# EAGLE design Power conversion board (EAGLE 7.7.0)
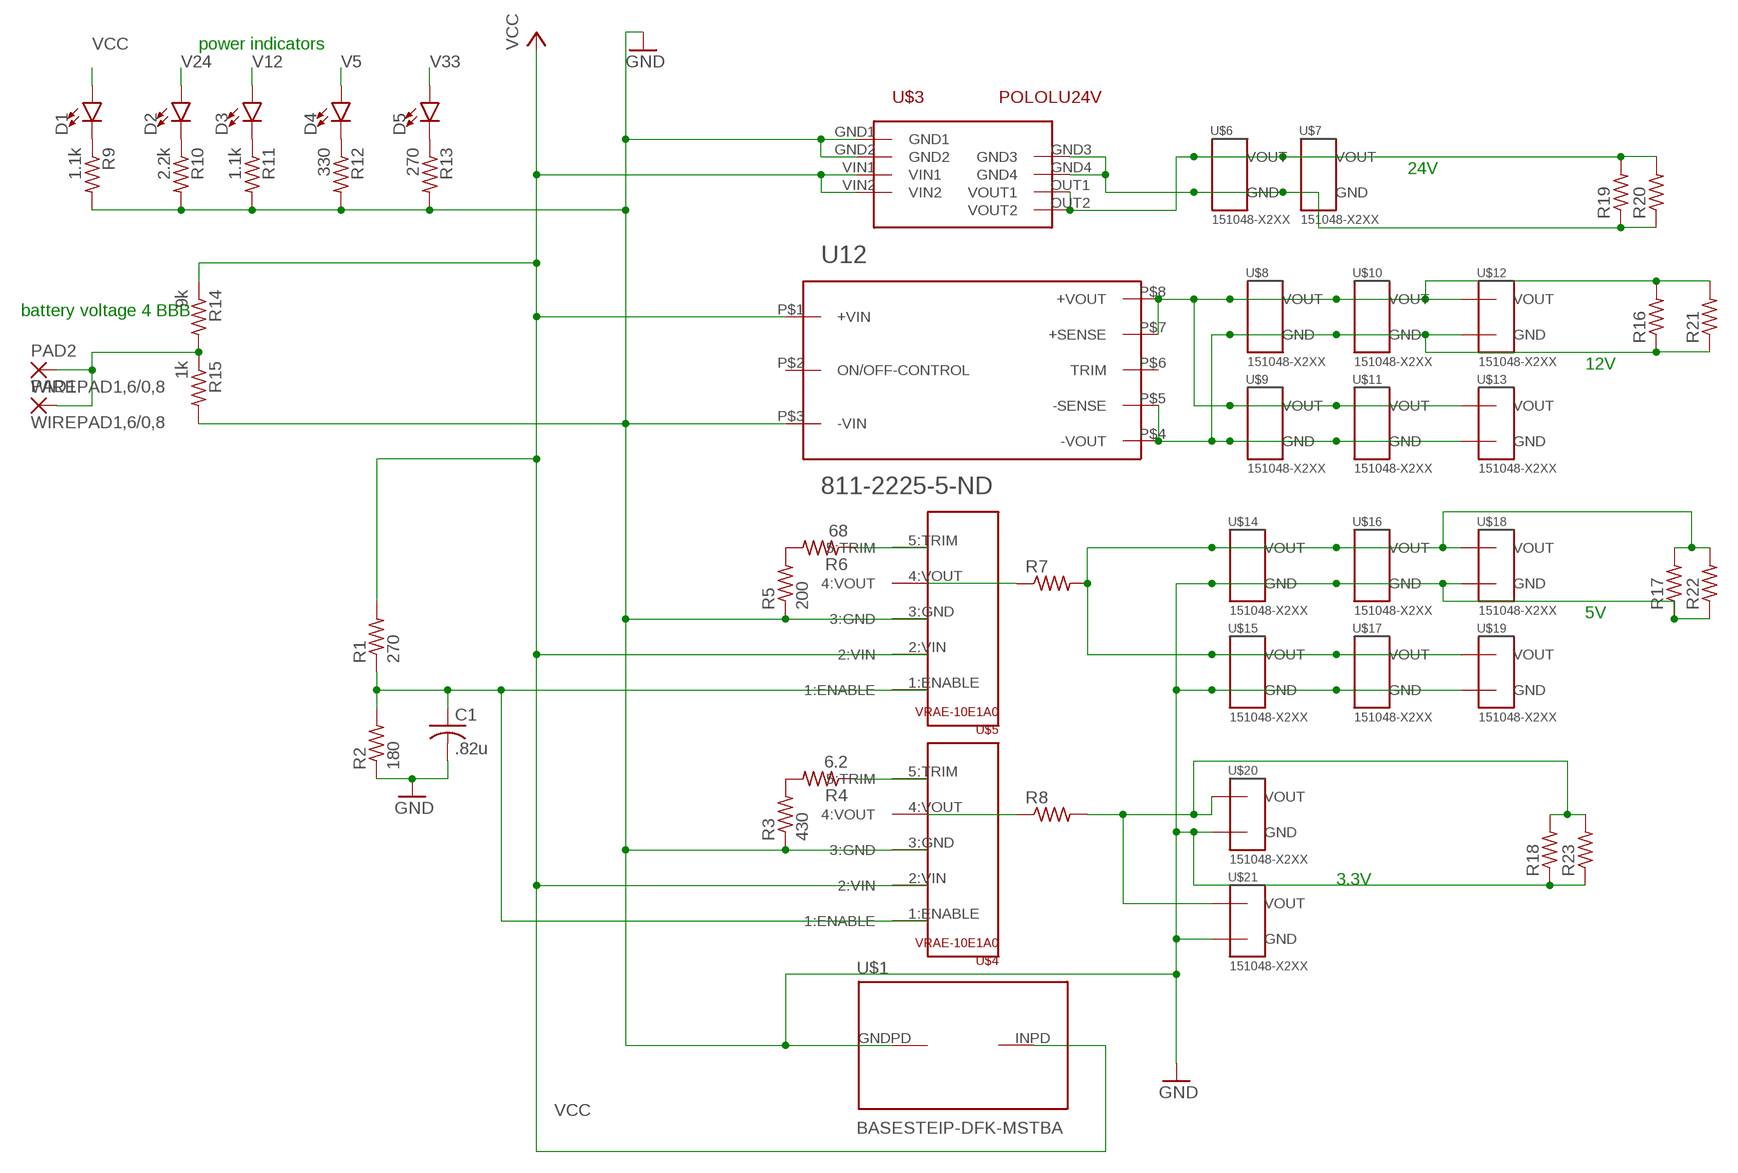
[diagram p0: schematic, sheet 1]

## Parts
C1  .82u  C-USC0603  [C0603]
D1  LED5MM  [LED_5MM]
D2  LED5MM  [LED_5MM]
D3  LED5MM  [LED_5MM]
D4  LED5MM  [LED_5MM]
D5  LED5MM  [LED_5MM]
PAD1  WIREPAD1,6/0,8  [1,6/0,8]
PAD2  WIREPAD1,6/0,8  [1,6/0,8]
R1  270  R-US_R0603  [R0603]
R2  180  R-US_R0603  [R0603]
R3  430  R-US_R0603  [R0603]
R4  6.2  R-US_R0603  [R0603]
R5  200  R-US_R0603  [R0603]
R6  68  R-US_R0603  [R0603]
R7  R-US_0204/5  [00PTCPACKAGE]
R8  R-US_0204/5  [00PTCPACKAGE]
R9  1.1k  R-US_R0603  [R0603]
R10  2.2k  R-US_R0603  [R0603]
R11  1.1k  R-US_R0603  [R0603]
R12  330  R-US_R0603  [R0603]
R13  270  R-US_R0603  [R0603]
R14  9k  R-US_R0603  [R0603]
R15  1k  R-US_R0603  [R0603]
R16  R-US_0204/5  [00PTCPACKAGE]
R17  R-US_0204/5  [00PTCPACKAGE]
R18  R-US_0204/5  [00PTCPACKAGE]
R19  R-US_0204/5  [00PTCPACKAGE]
R20  R-US_0204/5  [00PTCPACKAGE]
R21  R-US_0204/5  [00PTCPACKAGE]
R22  R-US_0204/5  [00PTCPACKAGE]
R23  R-US_0204/5  [00PTCPACKAGE]
U12  811-2225-5-ND  [811-2225-5-ND]
U$1  BASESTEIP-DFK-MSTBA  [BASESTRIP-DFK-MSTBA]
U$3  POLOLU24V  [POLOLU24]
U$4  VRAE-10E1A0  [BEL_VRAE-10E1A0]
U$5  VRAE-10E1A0  [BEL_VRAE-10E1A0]
U$6  151048-X2XX  [151048-X2XX]
U$7  151048-X2XX  [151048-X2XX]
U$8  151048-X2XX  [151048-X2XX]
U$9  151048-X2XX  [151048-X2XX]
U$10  151048-X2XX  [151048-X2XX]
U$11  151048-X2XX  [151048-X2XX]
U$12  151048-X2XX  [151048-X2XX]
U$13  151048-X2XX  [151048-X2XX]
U$14  151048-X2XX  [151048-X2XX]
U$15  151048-X2XX  [151048-X2XX]
U$16  151048-X2XX  [151048-X2XX]
U$17  151048-X2XX  [151048-X2XX]
U$18  151048-X2XX  [151048-X2XX]
U$19  151048-X2XX  [151048-X2XX]
U$20  151048-X2XX  [151048-X2XX]
U$21  151048-X2XX  [151048-X2XX]

## Nets
GND: C1.2 R2.1 R3.1 R5.1 R9.2 R10.2 R11.2 R12.2 R13.2 R15.2 R16.1 R17.1 R18.1 R19.1 R20.1 R21.1 R22.1 R23.1 U12.P$3(-VIN) U12.P$4(-VOUT) U12.P$5(-SENSE) U$1.GNDPD U$3.GND1 U$3.GND2 U$3.GND3 U$3.GND4 U$4.3:GND U$5.3:GND U$6.GND U$7.GND U$8.GND U$9.GND U$10.GND U$11.GND U$12.GND U$13.GND U$14.GND U$15.GND U$16.GND U$17.GND U$18.GND U$19.GND U$20.GND U$21.GND
N$1: C1.1 R1.1 R2.2 U$4.1:ENABLE U$5.1:ENABLE
N$2: R3.2 R4.2
N$3: R4.1 U$4.5:TRIM
N$4: R5.2 R6.2
N$5: R6.1 U$5.5:TRIM
N$7: PAD1.1(P) PAD2.1(P) R14.2 R15.1
N$8: R8.1 U$4.4:VOUT
N$9: R7.1 U$5.4:VOUT
N$14: D1.K(C) R9.1
N$15: D2.K(C) R10.1
N$16: D3.K(C) R11.1
N$17: D4.K(C) R12.1
N$18: D5.K(C) R13.1
V5: D4.A R7.2 R17.2 R22.2 U$14.VOUT U$15.VOUT U$16.VOUT U$17.VOUT U$18.VOUT U$19.VOUT
V12: D3.A R16.2 R21.2 U12.P$7(+SENSE) U12.P$8(+VOUT) U$8.VOUT U$9.VOUT U$10.VOUT U$11.VOUT U$12.VOUT U$13.VOUT
V24: D2.A R19.2 R20.2 U$3.OUT1(VOUT1) U$3.OUT2(VOUT2) U$6.VOUT U$7.VOUT
V33: D5.A R8.2 R18.2 R23.2 U$20.VOUT U$21.VOUT
VCC: D1.A R1.2 R14.1 U12.P$1(+VIN) U$1.INPD U$3.VIN1 U$3.VIN2 U$4.2:VIN U$5.2:VIN
Unconnected: U12.P$2(ON/OFF-CONTROL) U12.P$6(TRIM)

## Notes on the sheet
- power indicators
- 24V
- battery voltage 4 BBB
- 12V
- 5V
- 3.3V

## Library data of the parts
C1 = rcl:C-US: CAPACITOR, American symbol
D1-D5 = SparkFun-LED:LED: LED (Generic) Standard schematic elements and footprints for 5mm, 3mm, 1206, and 0603 sized LEDs. Generic LEDs with no color specified.
PAD1 PAD2 = wirepad:WIREPAD: Wire PAD connect wire on PCB
R1-R6 R9-R15 = resistor:R-US_: RESISTOR, American symbol
R7 R8 R16-R23 = 0ptc_littel:R-US_: RESISTOR, American symbol
U12 = 0DCDC convertor 12V:811-2225-5-ND: Isolated Module DC DC Converter 1 Output 12V 6A 9V - 36V Input
U$1 = 0connector-Pheonix pwr grn:BASESTEIP-DFK-MSTBA: Header, Nominal current: 12 A, Rated voltage (III/2): 320 V, Number of positions: 2, Pitch: 5.08 mm, Color: green, Contact surface: Tin, Assembly: Soldering
U$3 = 0polulu24V:POLOLU24V: Pololu 24V Step-Up Voltage Regulator U3V50F24. 0.1" spacingthrough hole connections. https://www.pololu.com/product/2569
U$4 U$5 = 0bel_5V_Converter:VRAE-10E1A0: 5 V Power Converter (VIN: 4.5 - 13.8, VOUT: .59 - 5.1), VRAE-10E1A0, 5 pin
U$6-U$21 = 0con-molex-cp6.5:151048-X2XX: 151048 Molex CP-6.5 connector. 2 circuits, thru hole. For HRC power conversion board. http://www.molex.com/molex/products/datasheet.jsp?part=active/1510481200_PCB_HEADERS.xml#documentsAnchor Alex Hoffman

## Net classes
0 default: clearance 0.205 mm

## Board
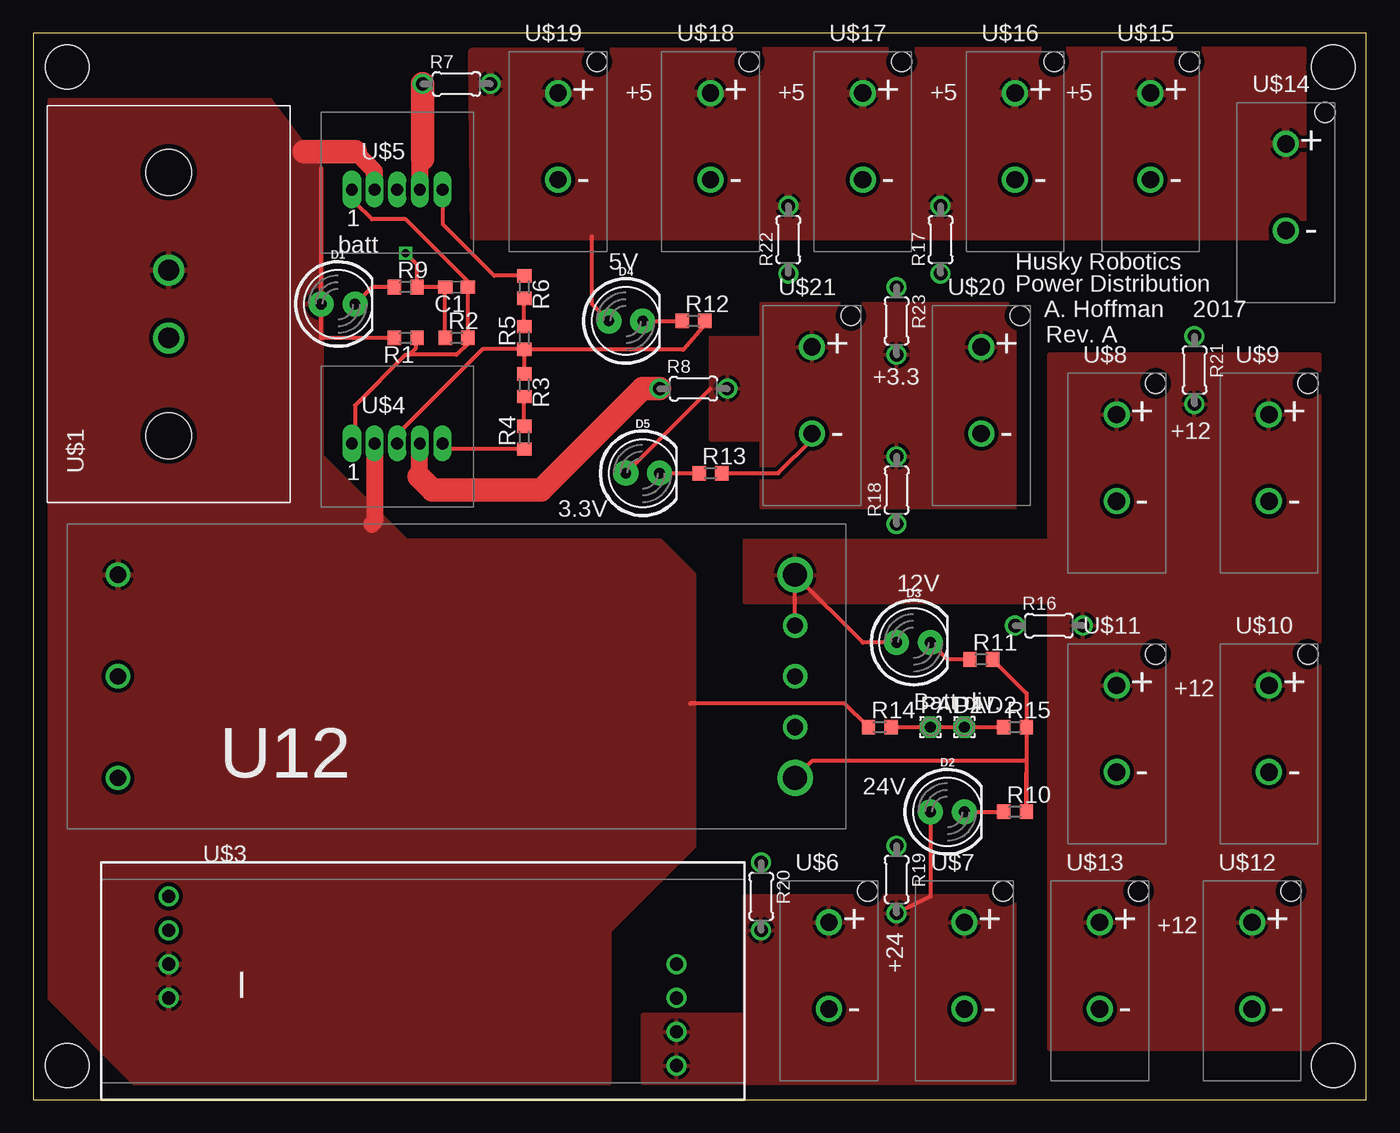
[diagram p1: board, top side]
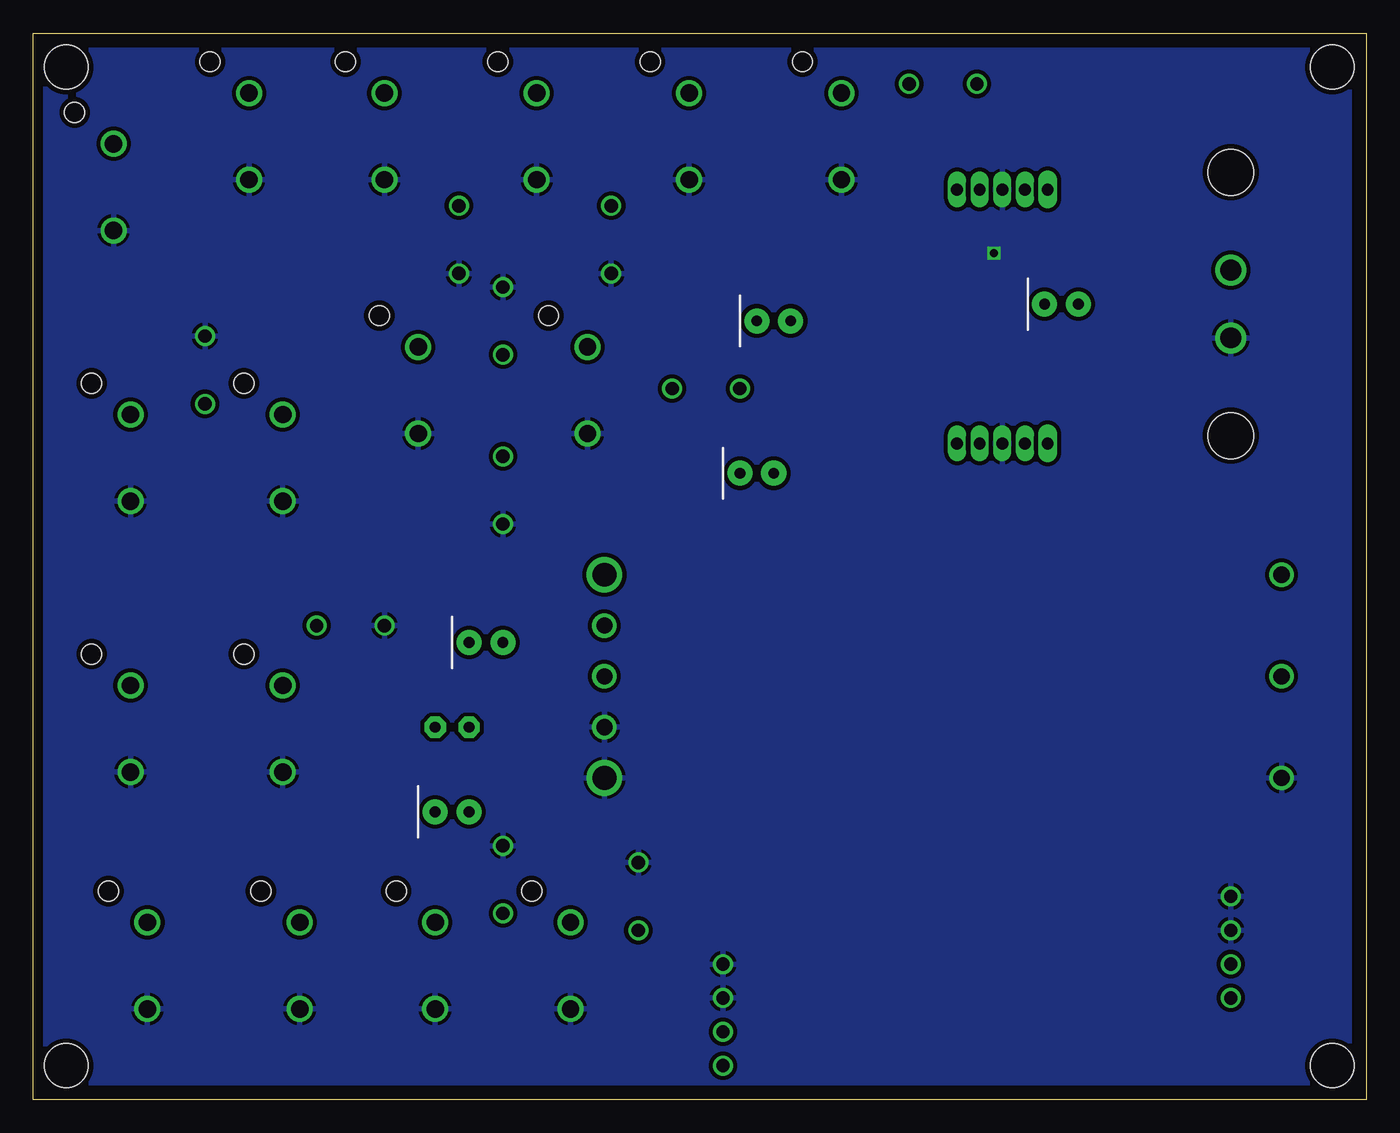
[diagram p2: board, bottom side, seen from below]

Size 100 x 80 mm. Coordinates in mm from the lower left corner, seen from the top.
Outline: 0,0 100,0 100,80 0,80 0,0
Copper layers (1*16): Top 0.0356mm / dielectric 1.5011mm / Bottom 0.0356mm
Design rules "oshpark-2layer": minimum track width 6mil, minimum drill 13mil, track to track 6mil, track to pad 6mil, pad to pad 6mil, via to via 6mil, smd to smd 6mil, copper to edge 15mil, drill to drill 6mil, minimum pad ring 7mil, minimum via ring 7mil, stop-mask expansion 2.5mil, vias tented up to drill 0mil, thermal gap 10mil
Holes 3.3 mm at 2.54,77.47 97.54,77.47 2.54,2.54 97.54,2.54

### Footprints (pad centres in the part's own frame; a part is rotated, then mirrored left to right if it is on the bottom)
C0603 = smd 1.1 x 1: 1 -0.85,0; 2 0.85,0
LED_5MM = drill 0.813 pad 1.88: A -1.27,0; K 1.27,0
1,6/0,8 = drill 0.813 pad 1.6 octagon: 1 0,0
R0603 = smd 1 x 1.1: 1 -0.85,0; 2 0.85,0
00PTCPACKAGE = drill 1: 1 -2.54,0; 2 2.54,0
811-2225-5-ND = drill 1.219 pad 1.727: P$1 -25.4,7.62; P$2 -25.4,0; P$3 -25.4,-7.62; P$5 25.4,-3.81; P$6 25.4,0; P$7 25.4,3.81 | drill 1.778 pad 2.286: P$4 25.4,-7.62; P$8 25.4,7.62
BASESTRIP-DFK-MSTBA = drill 1.55 pad 2.05: GNDPD -2.54,0; INPD 2.54,0 | hole 3.45: -9.88,0; 9.88,0
POLOLU24 = drill 1: GND1 -19.05,6.35; GND2 -19.05,3.81; GND3 19.05,1.27; GND4 19.05,-1.27; OUT1 19.05,-3.81; OUT2 19.05,-6.35; VIN1 -19.05,1.27; VIN2 -19.05,-1.27
BEL_VRAE-10E1A0 = drill 0.89 pad 1.422 long: 1:ENABLE 2.31,4.78 | drill 0.89 pad 1.016 long: 2:VIN 4.01,4.78; 3:GND 5.71,4.78; 4:VOUT 7.41,4.78; 5:TRIM 9.11,4.78
151048-X2XX = drill 1.3: GND 0,-2.1; VOUT 0,4.4 | hole 1.5: 2.92,6.75

### Placement (x,y rotation side)
C1  31.75,60.96 180 top
D1  22.86,59.69 0 top
D2  68.58,21.59 0 top
D3  66.04,34.29 0 top
D4  44.45,58.42 0 top
D5  45.72,46.99 0 top
PAD1  67.31,27.94 0 top
PAD2  69.85,27.94 0 top
R1  27.94,57.15 180 top
R2  31.75,57.15 0 top
R3  36.83,53.59 270 top
R4  36.83,49.66 90 top
R5  36.83,57.15 90 top
R6  36.83,60.96 270 top
R7  31.75,76.2 0 top
R8  49.53,53.34 0 top
R9  27.94,60.96 0 top
R10  73.66,21.59 0 top
R11  71.12,33.02 0 top
R12  49.53,58.42 0 top
R13  50.8,46.99 0 top
R14  63.5,27.94 0 top
R15  73.66,27.94 0 top
R16  76.2,35.56 0 top
R17  68.07,64.52 90 top
R18  64.77,45.72 90 top
R19  64.77,16.51 270 top
R20  54.61,15.24 270 top
R21  87.12,54.74 270 top
R22  56.64,64.52 90 top
R23  64.77,58.42 270 top
U12  31.75,31.75 0 top
U$1  10.16,59.69 90 top
U$3  29.21,8.89 0 top
U$4  21.59,44.45 0 top
U$5  21.59,63.5 0 top
U$6  59.69,8.89 0 top
U$7  69.85,8.89 0 top
U$8  81.28,46.99 0 top
U$9  92.71,46.99 0 top
U$10  92.71,26.67 0 top
U$11  81.28,26.67 0 top
U$12  91.44,8.89 0 top
U$13  80.01,8.89 0 top
U$14  93.98,67.31 0 top
U$15  83.82,71.12 0 top
U$16  73.66,71.12 0 top
U$17  62.23,71.12 0 top
U$18  50.8,71.12 0 top
U$19  39.37,71.12 0 top
U$20  71.12,52.07 0 top
U$21  58.42,52.07 0 top

### Tracks (layer width: path | path; a pad name or v marks a point on that pad's centre or on a via)
GND  (via drill 0.6)
  Top 0.305: R5.1 R3.1 | R2.1 C1.2 R9.2 28.79,62.65 v27.94,63.5 | R13.2 55.88,46.99 58.42,49.53 U$21.GND | R11.2 74.51,30.48 R15.2 74.51,25.4 | 74.51,25.4 R10.2 74.51,24.55 | 74.51,25.4 58.42,25.4 U12.P$4 | R5.1 33.69,56.3 27.3,49.91 U$4.3:GND | R12.2 50.38,58.13 48.77,56.26 37.05,56.26 R5.1
  pour Bottom (isolate 0.305): 1.27,78.74 1.27,1.27 99.06,1.27 99.06,78.74
N$1
  Top 0.305: U$5.1:ENABLE 24.13,69.32 24.13,67.31 25.4,66.04 27.94,66.04 33.02,60.96 C1.1 R2.2 32.6,56.73 31.75,55.88 28.19,55.88 | 28.19,55.88 27.94,55.88 24.13,52.07 24.13,49.46 U$4.1:ENABLE | 28.19,55.88 28.7,56.39 28.7,57.06 R1.1
N$2
  Top 0.305: R4.2 R3.2
N$3
  Top 0.305: R4.1 31.12,48.81 U$4.5:TRIM
N$4
  Top 0.305: R5.2 R6.2
N$5
  Top 0.305: R6.1 34.58,61.81 30.73,65.66 30.73,68.25 U$5.5:TRIM
N$7
  Top 0.305: R14.2 PAD1.1 PAD2.1 R15.1
N$8
  Top 1.27: U$4.4:VOUT 28.96,49.19 28.96,46.74
  Top 1.778: 28.96,46.74 29.97,45.72 38.1,45.72 45.72,53.34 R8.1
N$9
  Top 1.27: U$5.4:VOUT 29,70.4 29.21,70.61
  Top 1.778: 29.21,70.61 R7.1
N$14
  Top 0.305: R9.1 25.4,60.96 D1.K
N$15
  Top 0.305: D2.K R10.1
N$16
  Top 0.305: R11.1 68.58,33.02 D3.K
N$17
  Top 0.305: D4.K R12.1
N$18
  Top 0.305: D5.K R13.1
V5
  Top 0.305: 41.91,64.77 41.91,59.69 D4.A
  pour Top (isolate 0.305): 32.89,78.61 33.02,64.77 95.25,64.77 95.25,78.74
V12
  Top 0.305: D3.A 62.23,34.29 U12.P$8 U12.P$7
  pour Top (isolate 0.305): 96.52,55.88 76.2,55.88 76.2,41.91 53.34,41.91 53.34,37.34 76.2,37.34 76.2,3.81 96.52,3.81
V24
  Top 0.305: D2.A 67.31,15.24 R19.2
  pour Top (isolate 0.305): 45.72,6.35 45.72,1.27 73.66,1.27 73.66,15.24 53.34,15.24 53.34,6.35
V33
  Top 0.305: D5.A 50.8,53.34
  pour Top (isolate 0.305): 54.61,59.69 54.61,44.45 73.66,44.45 73.66,59.69
  pour Top (isolate 0.305): 54.61,57.15 50.8,57.15 50.8,49.53 54.61,49.53
VCC
  Top 0.305: R1.2 21.59,57.15 D1.A 21.59,69.85 | R14.1 60.87,29.72 49.28,29.72
  Top 1.27: U$5.2:VIN 25.6,69.65 24.13,71.12 | U$4.2:VIN 25.6,43.38 25.4,43.18
  Top 1.778: 24.13,71.12 20.32,71.12
  pour Top (isolate 0.305): 1.27,74.93 1.27,7.62 7.62,1.27 43.18,1.27 43.18,12.7 49.53,19.05 49.53,39.37 46.99,41.91 27.94,41.91 21.59,48.26 21.59,69.85 17.78,74.93

### Text on the board
tPlace: +5 | +5 | +5 | +5 | batt | 5V | Husky Robotics | Power Distribution | A. Hoffman | 2017 | Rev. A | +3.3 | +12 | 3.3V | 12V | +12 | Batt div. | 24V | +12 | +24